# Altium schematic sheet Power.SchDoc
size A4
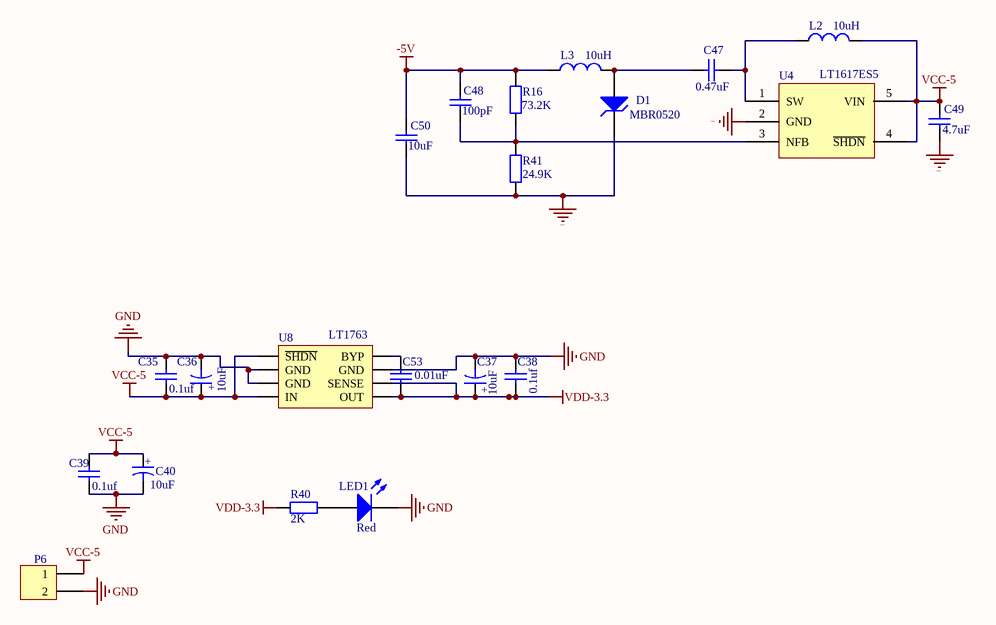
[diagram p0: Power.SchDoc]

## Parts
C35  value 0.1uf  [0805]  (hidden comment: Capacitor-0805)
C36  value 10uF  [钽电容1206（A3216）]  (hidden comment: 电解电容)
C37  value 10uF  [钽电容1206（A3216）]  (hidden comment: 电解电容)
C38  value 0.1uf  [0805]  (hidden comment: Capacitor-0805)
C39  value 0.1uf  [0805]  (hidden comment: Capacitor-0805)
C40  value 10uF  [钽电容1206（A3216）]  (hidden comment: 电解电容)
C47  value 0.47uF  [0805]  (hidden comment: Capacitor-0805)
C48  value 100pF  [0603]  (hidden comment: Capacitor-0603)
C49  value 4.7uF  [0805]  (hidden comment: Capacitor-0805)
C50  value 10uF  [0805]  (hidden comment: Capacitor-0805)
C53  value 0.01uF  [0603]  (hidden comment: Capacitor-0805)
D1  Name: MBR0520  [SMBJ20A]  (hidden comment: SMBJ20A)
L2  value 10uH  [0805]  (hidden comment: Inductor)
L3  value 10uH  [0805]  (hidden comment: Inductor)
LED1  Color: Red  [LED-0805]  (hidden comment: LED)
P6  端子  [2MM接线端子]  (value not drawn)
R16  value 73.2K  [0603]  (hidden comment: Resistor-0603)
R40  value 2K  [0603]  (hidden comment: Resistor-0603)
R41  value 24.9K  [0603]  (hidden comment: Resistor-0603)
U4  LT1617ES5  [SOT23-5]
U8  LT1763  [LT1963]

## Nets
-5V: C48.2 C50.2 L3.1 R16.2
GND: C35.2 C36.1 C37.1 C38.2 C39.1 C40.1 C49.1 C50.1 D1.2(K) LED1.2 P6.2 R41.1 U4.2(GND) U8.3(GND) U8.6(GND) U8.7(GND)
VCC-5: C35.1 C36.2 C39.2 C40.2 C49.2 L2.2 P6.1 U4.4(~{SHDN}) U4.5(VIN) U8.5(~{SHDN}) U8.8(IN)
VDD-3.3: C37.2 C38.1 C53.1 R40.2 U8.1(OUT) U8.2(SENSE)
NetC47_1: C47.1 L2.1 U4.1(SW)
NetC47_2: C47.2 D1.1(A) L3.2
NetC48_1: C48.1 R16.1 R41.2 U4.3(NFB)
NetC53_2: C53.2 U8.4(BYP)
NetLED1_1: LED1.1(A) R40.1

## Notes on the sheet
- (in symbol 电解电容) +

## Library data of the parts
C35 C38 C39 C47 C49 C50 C53 = Capacitor
LED1 = LED: Value: LED
U4 = LT1617ES5: Value: LT1617ES5
U8 = LT1763: Value: LT1763